# Altium schematic sheet motorEncoder.SchDoc: r-one Motor
size A; Date: 08/09/2011; DrawnBy: MRSL; Engineer: MRSL; Organization: Rice University; Revision: V11; SheetNumber: roneV11-motorEncoder; SheetTotal: 6; DocumentName: RoneV11-motorEncoder
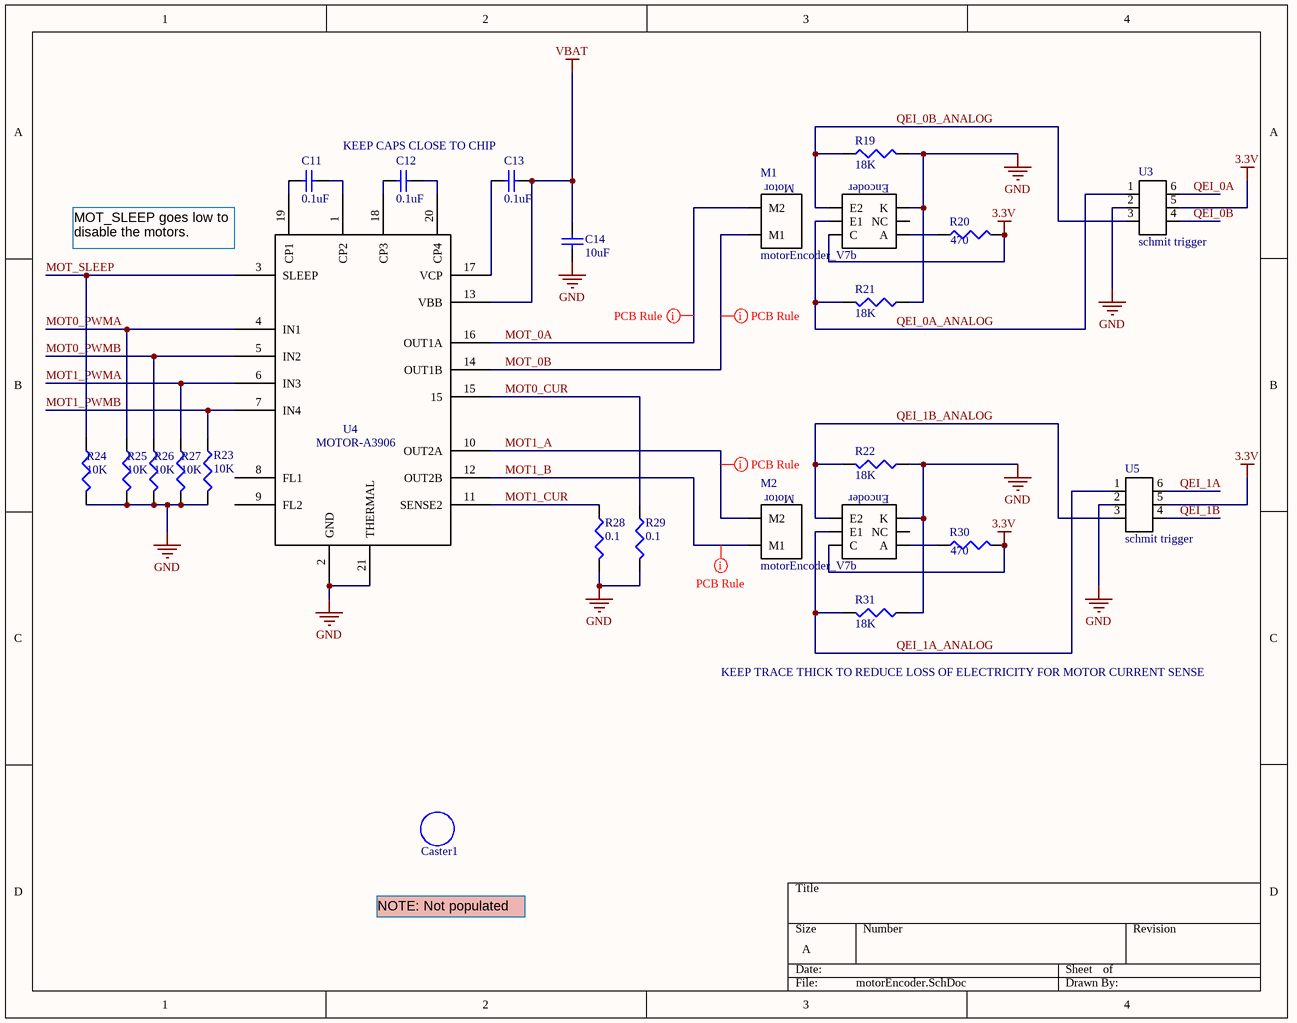
[diagram p0: motorEncoder.SchDoc]

## Parts
C11  value 0.1uF  [CAPC1005L]  (hidden comment: Cap Semi)
C12  value 0.1uF  [CAPC1005L]  (hidden comment: Cap Semi)
C13  value 0.1uF  [CAPC1005L]  (hidden comment: Cap Semi)
C14  value 10uF  [CAPC1608L]  (hidden comment: Cap Semi)
Caster1  non connect  [3/4"CASTER2]  (value not drawn)
M1  motorEncoder_V7b  [motorEncoder_V7b]
M2  motorEncoder_V7b  [motorEncoder_V7b]
R19  value 18K  [RESC1608L]
R20  value 470  [RESC1608L]
R21  value 18K  [RESC1608L]
R22  value 18K  [RESC1608L]
R23  value 10K  [RESC1608L]  (hidden comment: Res3)
R24  value 10K  [CAPC1608L]  (hidden comment: Res3)
R25  value 10K  [RESC1608L]  (hidden comment: Res3)
R26  value 10K  [RESC1608L]  (hidden comment: Res3)
R27  value 10K  [RESC1608L]  (hidden comment: Res3)
R28  value 0.1  [RESC1608L]  (hidden comment: Res3)
R29  value 0.1  [RESC1608L]  (hidden comment: Res3)
R30  value 470  [RESC1608L]
R31  value 18K  [RESC1608L]
U3  schmit trigger  [DCK(R-PDSO-C6)]
U4  MOTOR-A3906  [QFN-20]
U5  schmit trigger  [DCK(R-PDSO-C6)]

## Nets
3.3V: M1.C M2.C R20.2 R30.2 U3.5 U5.5
GND: C14.1 M1.K M2.K R19.2 R21.1 R22.1 R23.2 R24.2 R25.2 R26.2 R27.2 R28.2 R29.2 R31.1 U3.2 U4.2(GND) U4.21(THERMAL) U5.2
VBAT: C13.1 C14.2 U4.13(VBB)
MOT0_CUR: R29.1 U4.15
MOT0_PWMA: R25.1 U4.4(IN1)
MOT0_PWMB: R26.1 U4.5(IN2)
MOT1_A: M2.M2 U4.10(OUT2A)
MOT1_B: M2.M1 U4.12(OUT2B)
MOT1_CUR: R28.1 U4.11(SENSE2)
MOT1_PWMA: R27.1 U4.6(IN3)
MOT1_PWMB: R23.1 U4.7(IN4)
MOT_0A: M1.M2 U4.16(OUT1A)
MOT_0B: M1.M1 U4.14(OUT1B)
MOT_SLEEP: R24.1 U4.3(SLEEP)
QEI_0A: U3.6
QEI_0A_ANALOG: M1.E1 R21.2 U3.1
QEI_0B: U3.4
QEI_0B_ANALOG: M1.E2 R19.1 U3.3
QEI_1A: U5.6
QEI_1A_ANALOG: M2.E1 R31.2 U5.1
QEI_1B: U5.4
QEI_1B_ANALOG: M2.E2 R22.2 U5.3
NetC11_1: C11.1 U4.19(CP1)
NetC11_2: C11.2 U4.1(CP2)
NetC12_1: C12.1 U4.18(CP3)
NetC12_2: C12.2 U4.20(CP4)
NetC13_2: C13.2 U4.17(VCP)
NetM1_A: M1.A R20.1
NetM2_A: M2.A R30.1

Not connected (* = marked no-connect by the designer): M1 NC; M2 NC; U4 8(FL1) 9(FL2)

## Layout directives
rule Width Constraint [Pref Width = 20mil    Min Width = 10mil    Max Width = 25mil]: MOT1_A, MOT1_B, MOT_0A, MOT_0B

## Notes on the sheet
- KEEP CAPS CLOSE TO CHIP
- (near U4) MOT_SLEEP goes low to disable the motors.
- KEEP TRACE THICK TO REDUCE LOSS OF ELECTRICITY FOR MOTOR CURRENT SENSE
- NOTE: Not populated
- (in symbol motorEncoder_V7b) Motor; Encoder

## Library data of the parts
C11-C14 = Cap Semi: Capacitor (Semiconductor SIM Model); Published: 8-Jun-2000; LatestRevisionDate: 29-May-2009; LatestRevisionNote: IPC-7351 Footprint Added.; PackageReference: C1206; Publisher: Altium Limited; PackageDescription: Chip Capacitor
Caster1 = Caster 3/4in: This is just a space saver to get the caster onto the pcb
R19-R31 = Res3: Resistor; Published: 8-Jun-2000; LatestRevisionDate: 29-May-2009; LatestRevisionNote: IPC-7351 Footprint Added.; PackageReference: J1-0603; Publisher: Altium Limited; PackageDescription: Chip Resistor